# Altium project Source_Selector_V3.PrjPcb
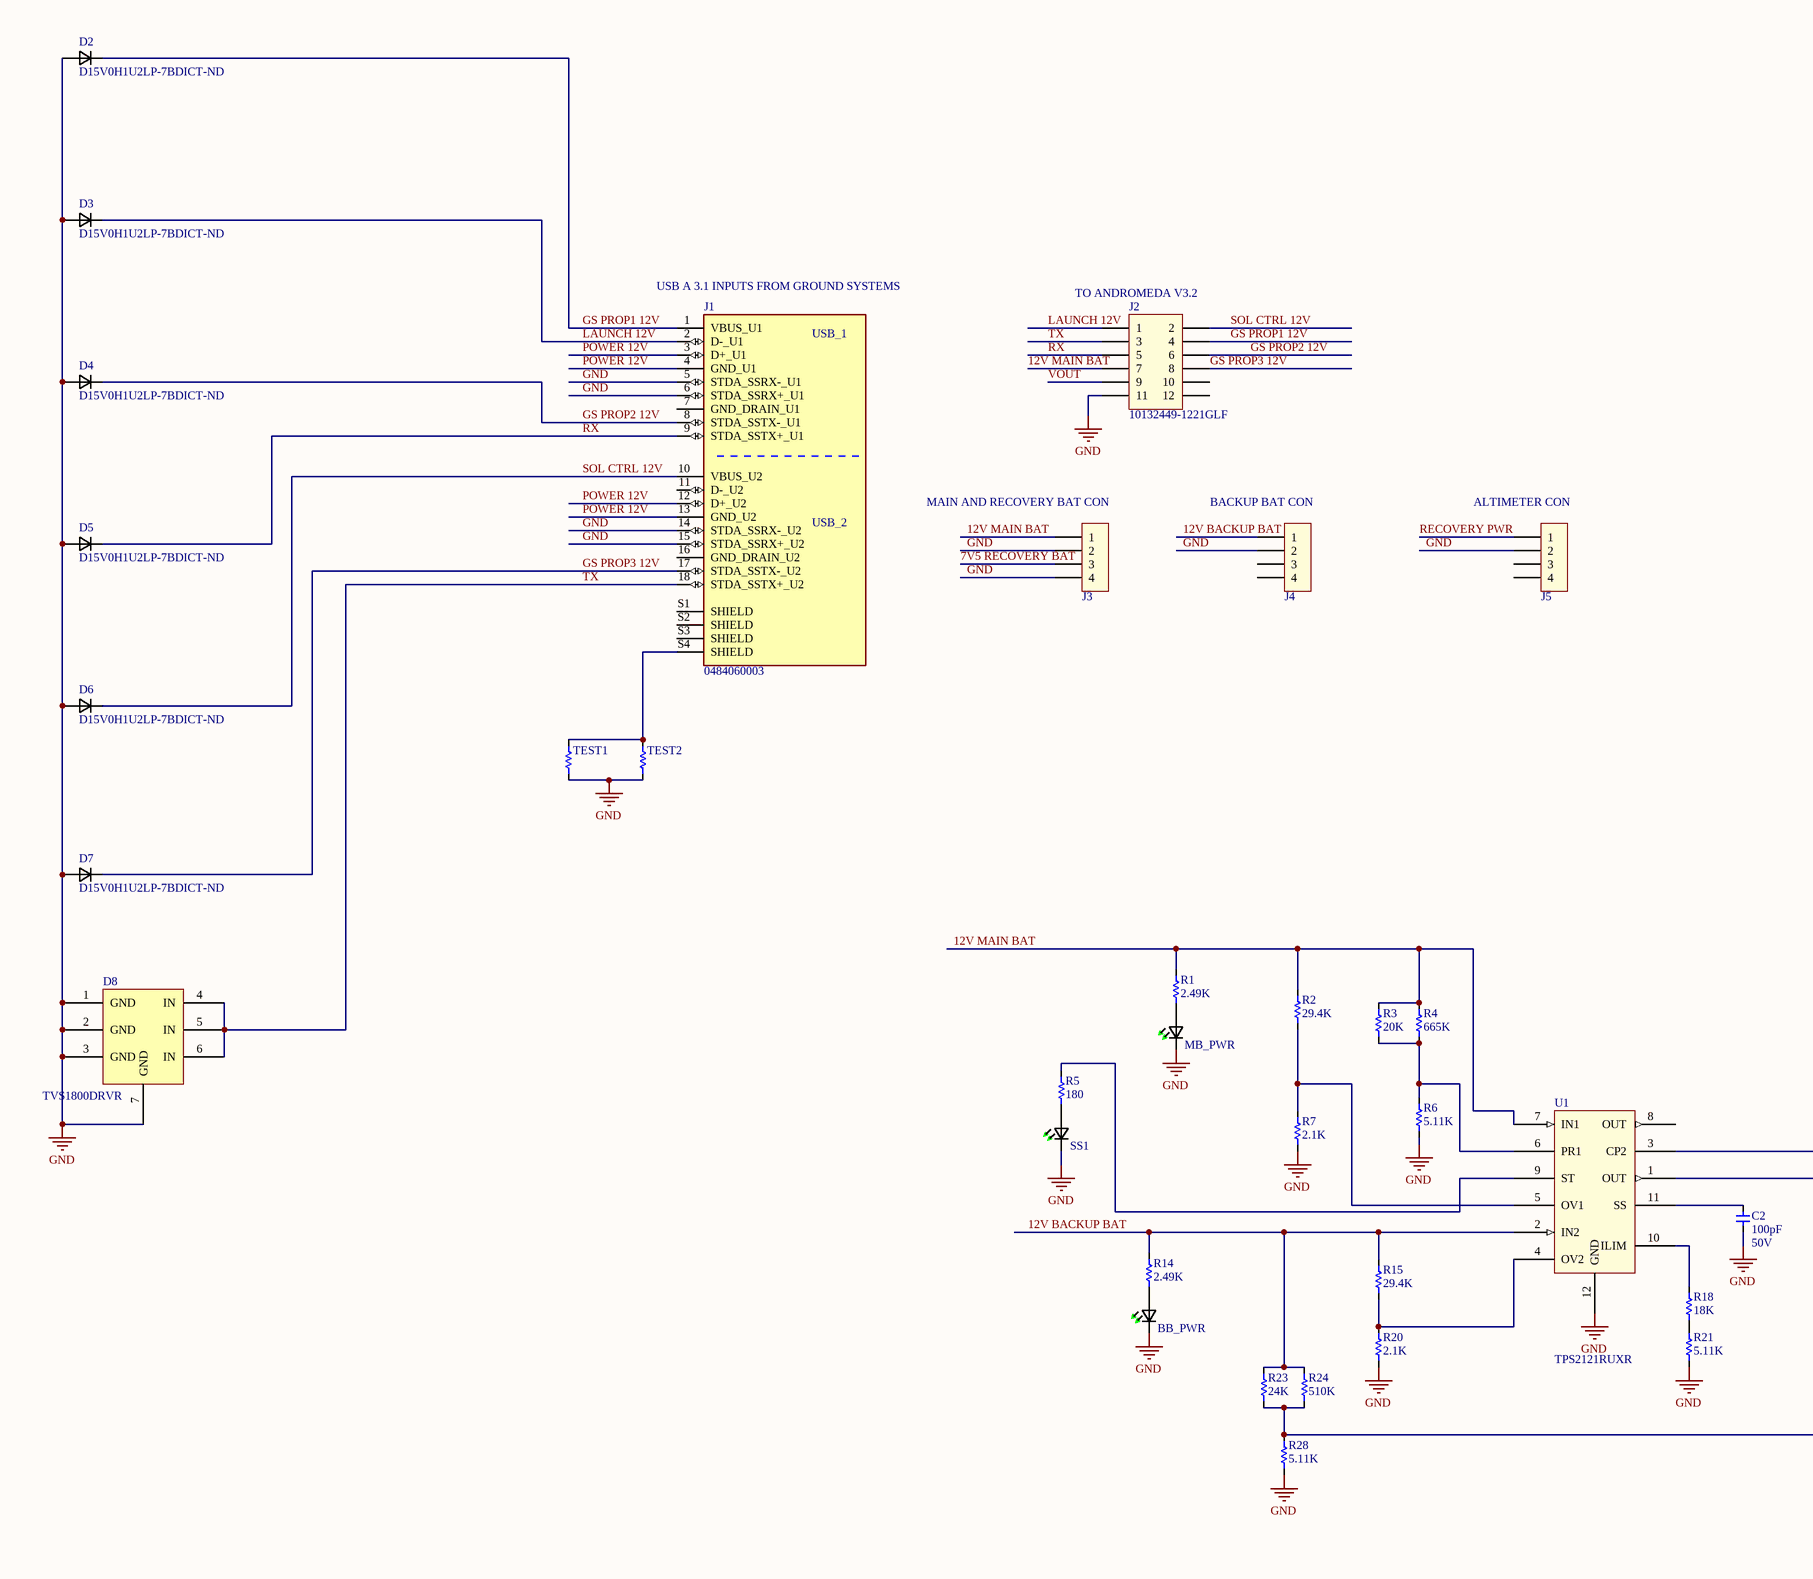
[diagram p0: Source_Selector_V3.SchDoc, left]
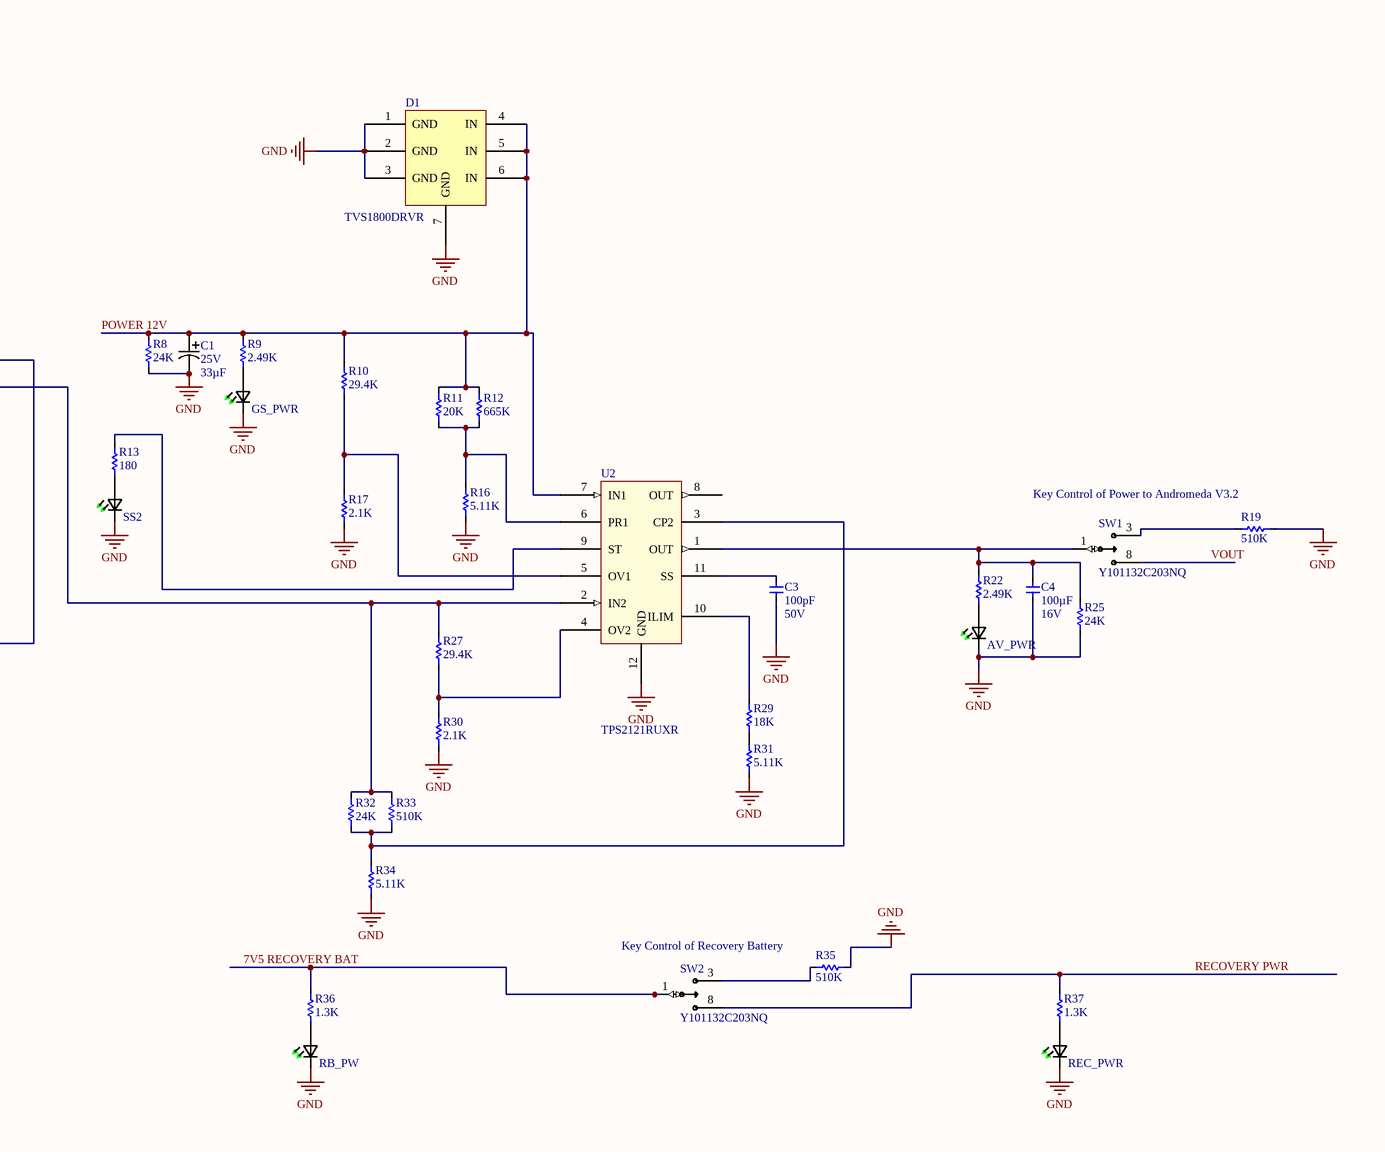
[diagram p1: Source_Selector_V3.SchDoc, right]
1 sheet, 67 parts. Net scope: global (net labels, ports and power ports of the same name join across sheets).
Board file: Source_Selector_V3.PcbDoc

## Sheet Source_Selector_V3.SchDoc
size A1

### Parts
AV_PWR  LTST-C191KGKT  [LTST-C191KGKT]  (value not drawn)
BB_PWR  LTST-C191KGKT  [LTST-C191KGKT]  (value not drawn)
C1  Voltage: 25V  Capacitance: 33µF  [PCAP_6.3x3-ELECT_NCA-M]  (hidden comment: UZG1E330MCL1GB)
C2  Capacitance: 100pF  Voltage - Rated: 50V  [0603[1608]]  (hidden comment: 04025A101JAT2A)
C3  Capacitance: 100pF  Voltage - Rated: 50V  [0603[1608]]  (hidden comment: 04025A101JAT2A)
C4  Capacitance: 100µF  Voltage - Rated: 16V  [CAPC3225X280N]  (hidden comment: EMK325ABJ107MM-P)
D1  TVS1800DRVR  [TVS1800DRVR]
D2  Supplier Part Number 1: D15V0H1U2LP-7BDICT-ND  [04025A101JAT2A]  (hidden comment: D15V0H1U2LP-7B)
D3  Supplier Part Number 1: D15V0H1U2LP-7BDICT-ND  [04025A101JAT2A]  (hidden comment: D15V0H1U2LP-7B)
D4  Supplier Part Number 1: D15V0H1U2LP-7BDICT-ND  [04025A101JAT2A]  (hidden comment: D15V0H1U2LP-7B)
D5  Supplier Part Number 1: D15V0H1U2LP-7BDICT-ND  [04025A101JAT2A]  (hidden comment: D15V0H1U2LP-7B)
D6  Supplier Part Number 1: D15V0H1U2LP-7BDICT-ND  [04025A101JAT2A]  (hidden comment: D15V0H1U2LP-7B)
D7  Supplier Part Number 1: D15V0H1U2LP-7BDICT-ND  [04025A101JAT2A]  (hidden comment: D15V0H1U2LP-7B)
D8  TVS1800DRVR  [TVS1800DRVR]
GS_PWR  LTST-C191KGKT  [LTST-C191KGKT]  (value not drawn)
J1  0484060003  [MOLEX_0484060003]
J2  10132449-1221GLF  [10132449-1221GLF]
J3  0430450400  [0430450400]  (value not drawn)
J4  0430450400  [0430450400]  (value not drawn)
J5  0430450400  [0430450400]  (value not drawn)
MB_PWR  LTST-C191KGKT  [LTST-C191KGKT]  (value not drawn)
R1  Resistance: 2.49K  [0603[1608]]  (hidden comment: ERA-3AEB2491V)
R2  Resistance: 29.4K  [0603[1608]]  (hidden comment: RMCF0603FT29K4)
R3  Resistance: 20K  [0603[1608]]  (hidden comment: RNCF0603BTC20K0)
R4  Resistance: 665K  [0603[1608]]  (hidden comment: RMCF0603FT665K)
R5  Resistance: 180  [0603[1608]]  (hidden comment: CRGCQ0603F180R)
R6  Resistance: 5.11K  [0603[1608]]  (hidden comment: RT0603BRD075K11L)
R7  Resistance: 2.1K  [0603[1608]]  (hidden comment: RQ73C1J2K1BTD)
R8  Resistance: 24K  [0603[1608]]  (hidden comment: RT0603BRD0724KL)
R9  Resistance: 2.49K  [0603[1608]]  (hidden comment: ERA-3AEB2491V)
R10  Resistance: 29.4K  [0603[1608]]  (hidden comment: RMCF0603FT29K4)
R11  Resistance: 20K  [0603[1608]]  (hidden comment: RNCF0603BTC20K0)
R12  Resistance: 665K  [0603[1608]]  (hidden comment: RMCF0603FT665K)
R13  Resistance: 180  [0603[1608]]  (hidden comment: CRGCQ0603F180R)
R14  Resistance: 2.49K  [0603[1608]]  (hidden comment: ERA-3AEB2491V)
R15  Resistance: 29.4K  [0603[1608]]  (hidden comment: RMCF0603FT29K4)
R16  Resistance: 5.11K  [0603[1608]]  (hidden comment: RT0603BRD075K11L)
R17  Resistance: 2.1K  [0603[1608]]  (hidden comment: RQ73C1J2K1BTD)
R18  Resistance: 18K  [0603[1608]]  (hidden comment: RT0603BRE0718KL)
R19  Resistance: 510K  [0603[1608]]  (hidden comment: CPF0603B510KE1)
R20  Resistance: 2.1K  [0603[1608]]  (hidden comment: RQ73C1J2K1BTD)
R21  Resistance: 5.11K  [0603[1608]]  (hidden comment: RT0603BRD075K11L)
R22  Resistance: 2.49K  [0603[1608]]  (hidden comment: ERA-3AEB2491V)
R23  Resistance: 24K  [0603[1608]]  (hidden comment: RT0603BRD0724KL)
R24  Resistance: 510K  [0603[1608]]  (hidden comment: CPF0603B510KE1)
R25  Resistance: 24K  [0603[1608]]  (hidden comment: RT0603BRD0724KL)
R27  Resistance: 29.4K  [0603[1608]]  (hidden comment: RMCF0603FT29K4)
R28  Resistance: 5.11K  [0603[1608]]  (hidden comment: RT0603BRD075K11L)
R29  Resistance: 18K  [0603[1608]]  (hidden comment: RT0603BRE0718KL)
R30  Resistance: 2.1K  [0603[1608]]  (hidden comment: RQ73C1J2K1BTD)
R31  Resistance: 5.11K  [0603[1608]]  (hidden comment: RT0603BRD075K11L)
R32  Resistance: 24K  [0603[1608]]  (hidden comment: RT0603BRD0724KL)
R33  Resistance: 510K  [0603[1608]]  (hidden comment: CPF0603B510KE1)
R34  Resistance: 5.11K  [0603[1608]]  (hidden comment: RT0603BRD075K11L)
R35  Resistance: 510K  [0603[1608]]  (hidden comment: CPF0603B510KE1)
R36  Resistance: 1.3K  [0603[1608]]  (hidden comment: MCT06030C1301FP500)
R37  Resistance: 1.3K  [0603[1608]]  (hidden comment: MCT06030C1301FP500)
RB_PW  LTST-C191KGKT  [LTST-C191KGKT]  (value not drawn)
REC_PWR  LTST-C191KGKT  [LTST-C191KGKT]  (value not drawn)
SS1  LTST-C191KGKT  [LTST-C191KGKT]  (value not drawn)
SS2  LTST-C191KGKT  [LTST-C191KGKT]  (value not drawn)
SW1  Y101132C203NQ  [Y101132C203NQ]
SW2  Y101132C203NQ  [Y101132C203NQ]
TEST1  RQ73C1J2K1BTD  [0603[1608]]  (value not drawn)
TEST2  RQ73C1J2K1BTD  [0603[1608]]  (value not drawn)
U1  TPS2121RUXR  [IC_TPS2121RUXR]
U2  TPS2121RUXR  [IC_TPS2121RUXR]

### Nets
GND: AV_PWR.1(K2) BB_PWR.1(K2) C1.2 C2.1 C3.1 C4.1 D1.1(GND) D1.2(GND) D1.3(GND) D1.7(GND) D2.2(A2) D3.2(A2) D4.2(A2) D5.2(A2) D6.2(A2) D7.2(A2) D8.1(GND) D8.2(GND) D8.3(GND) D8.7(GND) GS_PWR.1(K2) J1.5(STDA_SSRX-_U1) J1.6(STDA_SSRX+_U1) J1.14(STDA_SSRX-_U2) J1.15(STDA_SSRX+_U2) J2.11 J3.2 J3.4 J4.2 J5.2 MB_PWR.1(K2) R6.1 R7.1 R8.1 R16.1 R17.1 R19.1 R20.1 R21.1 R25.1 R28.1 R30.1 R31.1 R34.1 R35.1 RB_PW.1(K2) REC_PWR.1(K2) SS1.1(K2) SS2.1(K2) TEST1.1 TEST2.1 U1.12(GND) U2.12(GND)
7V5 RECOVERY BAT: J3.3 R36.2 SW2.1
12V BACKUP BAT: J4.1 R14.2 R15.2 R23.2 R24.2 U1.2(IN2)
12V MAIN BAT: J2.7 J3.1 R1.2 R2.2 R3.2 R4.2 U1.7(IN1)
GS PROP1 12V: D2.1(K2) J1.1(VBUS_U1) J2.4
GS PROP2 12V: D4.1(K2) J1.8(STDA_SSTX-_U1) J2.6
GS PROP3 12V: D7.1(K2) J1.17(STDA_SSTX-_U2) J2.8
LAUNCH 12V: D3.1(K2) J1.2(D-_U1) J2.1
POWER 12V: C1.1 D1.4(IN) D1.5(IN) D1.6(IN) J1.3(D+_U1) J1.4(GND_U1) J1.12(D+_U2) J1.13(GND_U2) R8.2 R9.2 R10.2 R11.2 R12.2 U2.7(IN1)
RECOVERY PWR: J5.1 R37.2 SW2.8
RX: D5.1(K2) J1.9(STDA_SSTX+_U1) J2.5
SOL CTRL 12V: D6.1(K2) J1.10(VBUS_U2) J2.2
TX: D8.4(IN) D8.5(IN) D8.6(IN) J1.18(STDA_SSTX+_U2) J2.3
VOUT: J2.9 SW1.8
NetAV_PWR_2: AV_PWR.2(A2) R22.1
NetBB_PWR_2: BB_PWR.2(A2) R14.1
NetC2_2: C2.2 U1.11(SS)
NetC3_2: C3.2 U2.11(SS)
NetC4_2: C4.2 R22.2 R25.2 SW1.1 U2.1(OUT)
NetGS_PWR_2: GS_PWR.2(A2) R9.1
NetJ1_S4: J1.S4(SHIELD) TEST1.2 TEST2.2
NetMB_PWR_2: MB_PWR.2(A2) R1.1
NetR2_1: R2.1 R7.2 U1.5(OV1)
NetR3_1: R3.1 R4.1 R6.2 U1.6(PR1)
NetR5_1: R5.1 SS1.2(A2)
NetR5_2: R5.2 U1.9(ST)
NetR10_1: R10.1 R17.2 U2.5(OV1)
NetR11_1: R11.1 R12.1 R16.2 U2.6(PR1)
NetR13_1: R13.1 SS2.2(A2)
NetR13_2: R13.2 U2.9(ST)
NetR15_1: R15.1 R20.2 U1.4(OV2)
NetR18_1: R18.1 R21.2
NetR18_2: R18.2 U1.10(ILIM)
NetR19_2: R19.2 SW1.3
NetR23_1: R23.1 R24.1 R28.2 U1.3(CP2)
NetR27_1: R27.1 R30.2 U2.4(OV2)
NetR27_2: R27.2 R32.2 R33.2 U1.1(OUT) U2.2(IN2)
NetR29_1: R29.1 R31.2
NetR29_2: R29.2 U2.10(ILIM)
NetR32_1: R32.1 R33.1 R34.2 U2.3(CP2)
NetR35_2: R35.2 SW2.3
NetR36_1: R36.1 RB_PW.2(A2)
NetR37_1: R37.1 REC_PWR.2(A2)

Not connected (* = marked no-connect by the designer): J1 7(GND_DRAIN_U1) 11(D-_U2) 16(GND_DRAIN_U2) S1(SHIELD) S2(SHIELD) S3(SHIELD); J2 10 12; J4 3 4; J5 3 4; U1 8(OUT); U2 8(OUT)

### Notes on the sheet
- (near J1) USB A 3.1 INPUTS FROM GROUND SYSTEMS
- (near J2) TO ANDROMEDA V3.2
- (near J3) MAIN AND RECOVERY BAT CON
- (near J4) BACKUP BAT CON
- (near J5) ALTIMETER CON
- Key Control of Power to Andromeda V3.2
- Key Control of Recovery Battery
- (in symbol 0484060003) USB_1; USB_2

### Library data of the parts
AV_PWR BB_PWR GS_PWR MB_PWR RB_PW REC_PWR SS1 SS2 = LTST-C191KGKT: LED GREEN CLEAR SMD 0603; Manufacturer: Lite-On Inc.; Lens Color: Colourless; Millicandela Rating: 35mcd; Lens Style: Rectangle with Flat Top; Lens Size: 1.10mm x 0.80mm; Voltage - Forward (Vf) (Typ): 2V; Current - Test: 20mA; Viewing Angle: 130°; Wavelength - Dominant: 571nm; Wavelength - Peak: 574nm; ComponentLink1Description: Datasheet; ComponentLink1URL: http://optoelectronics.liteon.com/upload/download/DS22-2000-228/LTST-C191KGKT.PDF; Manufacturer Part Number: LTST-C191KGKT; Colour: Green; Lens Transparency: Clear; Mounting Type: Surface Mount; Package / Case: 0603 (1608 Metric); Size / Dimension: 1.60mm L x 0.80mm W; Height (Max): 0.65mm; Supplier 1: Digi-Key; Supplier Part Number 1: 160-1446-1-ND
C1 = UZG1E330MCL1GB: CAP ALUM 33UF 20% 25V SMD; Manufacturer: Nichicon; Lifetime @ Temp.: 1000 Hrs @ 105°C; Ripple Current @ Low Frequency: 42mA @ 120Hz; Ripple Current @ High Frequency: 63mA @ 10kHz; Manufacturer_Part_Number: UZG1E330MCL1GB; Tolernace: ±20%; Operating Temp.: -40°C ~ 105°C
C2 C3 = 04025A101JAT2A: CAP CER 100PF 50V C0G/NP0 0402; Manufacturer: AVX Corporation; Tolerance: ±5%; Temperature Coefficient: C0G, NP0; Operating Temperature: -55°C ~ 125°C; Mounting Type: Surface Mount, MLCC; Package / Case: 0402 (1005 Metric); Size / Dimension: 0.039" L x 0.020" W (1.00mm x 0.50mm); Manufacturer Part Number: 04025A101JAT2A; Thickness (Max): 0.022" (0.56mm); ComponentLink1Description: Datasheet; ComponentLink1URL: http://datasheets.avx.com/C0GNP0-Dielectric.pdf; Supplier 1: Digi-Key; Supplier Part Number 1: 478-1082-1-ND
C4 = EMK325ABJ107MM-P: CAP CER 100UF 16V X5R 1210; Manufacturer: Taiyo Yuden; Tolerance: ±20%; Temperature Coefficient: X5R; Operating Temperature: -55°C ~ 85°C; Mounting Type: Surface Mount, MLCC; Package / Case: 1210 (3225 Metric); Size / Dimension: 0.126"" L x 0.098"" W (3.20mm x 2.50mm); Manufacturer Part Number: EMK325ABJ107MM-P; Thickness (Max): 0.110"" (2.80mm); ComponentLink1Description: Datasheet; ComponentLink1URL: https://ds.yuden.co.jp/TYCOMPAS/ut/detail?pn=EMK325ABJ107MM-P%20&u=M; Supplier 1: Digi-Key; Supplier Part Number 1: 587-5426-1-ND
D1 D8 = TVS1800DRVR: UNIDIR PRECISION SURGE DIODE; Voltage - Clamping: 24.7V; Mounting Type: Surface Mount; Manufacturer ID: TVS1800DRVR
D2-D7 = D15V0H1U2LP-7B: TVS DIODE 15VWM 27VC DFN1006-2; Manufacturer: Diodes Incorporated; ComponentLink1Description: Datasheet; ComponentLink1URL: http://optoelectronics.liteon.com/upload/download/DS22-2000-228/LTST-C191KGKT.PDF; Manufacturer Part Number: D15V0H1U2LP-7B; Supplier 1: Digi-Key
J1 = 0484060003: USB-A _USB TYPE-A_, Stacked USB 3.0 _USB 3.1 Gen 1, Superspeed_ Receptacle Connector 18 Position Through Hole, Right Angle; MF: Molex; Package: None; MP: 0484060003; Price: None; Availability: Unavailable; Value: *; SnapEDA_Link: https://www.snapeda.com/parts/0484060003/Molex/view-part/424547/?ref=snap
J2 = 10132449-1221GLF: CONN HEADER R/A 12POS 3MM; Manufacturer: Amphenol ICC (FCI); Pitch - Mating: 0.118" (3.00mm); Number of Positions: 12; Number of Positions Loaded: All; Style: Board to Cable/Wire; Shrouding: Shrouded - 4 Wall; Contact Length - Post: 0.126" (3.20mm); Material Flammability Rating: UL94 V-0; Voltage Rating: 250V; ComponentLink1Description: Datasheet; ComponentLink1URL: https://cdn.amphenol-icc.com/media/wysiwyg/files/documentation/datasheet/boardwiretoboard/bwb_minitekpwr3.0_hcc.pdf?__cf_chl_jschl_tk__=5b50c337d7977d3136f5a7e9c1a5138446a86722-1578191481-0-AdRe7fXYrldvOZ_oqyXIDS1Fw-yIkYCF-QCdaR8gv5bvudzwMePuF1OnY_qX9R1SRbUtnU8KyfMeQWvo-tgbYDs0UY0fEf2VYly7RnE44wN6RCRwe79pwwTkwB-vrp_E3FFt_m8Gv1l0VQgfDvqJJh9NWsFdXN6uiHYgEWJHQlxni9pgO_Rgu9b74Q_adNTuUPkDts4F_sjwuXFS2gwZ4qhDRVIbOsJk9z2IFwtIQbJe2Vjr12REDPUJnSIFI5L_m3PVR56FMV99EE0fexLx9E4Xzm8z4yXY4QuL_nxicuZLnFM8rKw84cv6VQDtrcv1h8b5URSWpnxkbKmN-6xqBT_N2gwuiomQytubllip4AB4QtXNO4uZy8p0Kaq8ZXDsS9f0XOGpGrNCvURFRCr5YrB2nakG2mZwStZMD_Rr-W-x1kEQ5VT0_Uar3vHfURsPPw; ComponentLink2Description: Drawing; ComponentLink2URL: https://cdn.amphenol-icc.com/media/wysiwyg/files/drawing/10132449.pdf?__cf_chl_jschl_tk__=3fb7538f61705fd3db72d6547b71e22025aaeae6-1578191484-0-ARZmBU2d2iTfwOyvkDW6juGvz8Wa7jPk-lPTAGC3bi6AwA2PAOw_83XbqimUoaj63c73oghkBl5EBlxfVnJt5FnKIy9_Ampqry6wpxN3P9yFfGzzu2bzrkjXc8H98cNGfE4yNZOx4lVYAc0DYF8iUgUBt3ot3PAqRWTuL_OE0dIKXvMd7u_4fU7igR1oB3QBFAu564mexcV1Dg4phJ9BA4kHFs6CIC10MmA2ZlPsaDWmfr6ivcYRarJOnVBN46Piz5s9Rafd2OkXuSIM4yJjlli4dKOItRDrJD3hRC0iA9RVgXipc9Ibd3Qny2RaW6xQiV-dovtBkpyFUGJQUyK5Difre6fQiv59Vrr2PfvD74WBgrERIBaIQ4JCRXFCC0XHSA; Supplier 1: Digi-Key; Supplier Part Number 1: 609-5289-ND; Contact Type: Male Pin; Number of Rows: 2; Row Spacing - Mating: 0.118" (3.00mm); Mounting Type: Through Hole, Right Angle; Termination: Solder; Fastening Type: Locking Ramp; Insulation Height: 0.343" (8.71mm); Contact Shape: Square; Contact Finish - Mating: Tin; Contact Finish - Post: Tin; Contact Material: Copper Alloy; Insulation Material: Polyamide (PA9T), Nylon 9T; Features: Board Lock, Glow Wire Compliant; Operating Temperature: -40°C ~ 105°C; Insulation Color: Black; Manufacturer Part Number: 10132449-1221GLF
J3-J5 = 0430450400: CONN HEADER R/A 4POS 3MM; Manufacturer: Molex; Number of Positions: 4; Row Spacing - Mating: 0.118" (3.00mm); Shrouding: Shrouded - 4 Wall; Contact Length - Post: 0.125" (3.18mm); Material Flammability Rating: UL94 V-0; Current Rating (Amps): 8A; Voltage Rating: 600V; ComponentLink1Description: Datasheet; ComponentLink1URL: https://www.molex.com/pdm_docs/sd/430450400_sd.pdf; ComponentLink2Description: Product Specification; ComponentLink2URL: https://www.molex.com/pdm_docs/ps/PS-43045.pdf; Manufacturer Part Number: 0430450400; Contact Type: 0.118" (3.00mm); Number of Rows: 2; Mounting Type: Through Hole, Right Angle; Termination: Solder; Fastening Type: Locking Ramp; Insulation Height: 0.290" (7.37mm); Contact Shape: Square; Contact Finish - Mating: Tin; Contact Finish Thickness - Mating: 100.0µin (2.54µm); Contact Finish - Post: Tin; Contact Material: Brass; Insulation Material: Liquid Crystal Polymer (LCP), Glass Filled; Features: Board Lock; Insulation Color: Black; Supplier 1: Digi-Key; Supplier Part Number 1: WM1814-ND
R1 R9 R14 R22 = ERA-3AEB2491V: RES SMD 2.49KOHM 0.1% 1/10W 0603; Manufacturer: Panasonic Electronic Components; Power  (W): 0.1W; Temperature Coefficient: ±25ppm/°C; Package: 0603 (1608 Metric); Tolerance: ±0.1%; Operating Temperature: -55°C ~ 155°C; Composition: Thin Film; Manufacturer Part Number: ERA-3AEB2491V; ComponentLink1Description: Datasheet; ComponentLink1URL: https://industrial.panasonic.com/cdbs/www-data/pdf/RDM0000/AOA0000C307.pdf; Supplier 1: Digi-Key; Supplier Part Number 1: P2.49KDBCT-ND
R2 R10 R15 R27 = RMCF0603FT29K4: RES 29.4K OHM 1% 1/10W 0603; Manufacturer: Stackpole Electronics Inc; Power  (W): 0.1W; Temperature Coefficient: ±100ppm/°C; Package: 0603 (1608 Metric); Tolerance: ±1%; Operating Temperature: -55°C ~ 155°C; Composition: Thick Film; Manufacturer Part Number: RMCF0603FT29K4; Supplier 1: Digi-Key; Supplier Part Number 1: 738-RMCF0603FT29K4CT-ND
R3 R11 = RNCF0603BTC20K0: RES 20K OHM 0.1% 1/10W 0603; Manufacturer: Stackpole Electronics Inc; Power  (W): 0.1W; Temperature Coefficient: ±50ppm/°C; Package: 0603 (1608 Metric); Tolerance: ±0.1%; Operating Temperature: -55°C ~ 155°C; Composition: Thin Film; Manufacturer Part Number: RNCF0603BTC20K0; ComponentLink1Description: Datasheet; ComponentLink1URL: https://www.seielect.com/catalog/sei-rncf.pdf; Supplier 1: Digi-Key; Supplier Part Number 1: RNCF0603BTC20K0CT-ND
R4 R12 = RMCF0603FT665K: RES 665K OHM 1% 1/10W 0603; Manufacturer: Stackpole Electronics Inc; Power  (W): 0.1W; Temperature Coefficient: ±100ppm/°C; Package: 0603 (1608 Metric); Tolerance: ±1%; Operating Temperature: -55°C ~ 155°C; Composition: Thick Film; Manufacturer Part Number: RMCF0603FT665K; ComponentLink1Description: Datasheet; ComponentLink1URL: https://www.seielect.com/catalog/sei-rmcf_rmcp.pdf; Supplier 1: Digi-Key; Supplier Part Number 1: RMCF0603FT665KCT-ND
R5 R13 = CRGCQ0603F180R: RES 180 OHM 1% 1/10W 0603; Manufacturer: TE Connectivity Passive Product; Power  (W): 0.1W; Tolerance: ±0.1%; Temperature Coefficient: ±50ppm/°C; Package: 0603 (1608 Metric); Operating Temperature: -55°C ~ 155°C; Composition: Thin Film; Manufacturer Part Number: CRGCQ0603F180R; ComponentLink1Description: Datasheet; ComponentLink1URL: https://www.yageo.com/upload/media/product/productsearch/datasheet/rchip/PYu-RT_1-to-0.01_RoHS_L_12.pdf; Supplier 1: Digi-Key; Supplier Part Number 1: A129679CT-ND
R6 R16 R21 R28 R31 R34 = RT0603BRD075K11L: RES SMD 5.11KOHM 0.1% 1/10W 0603; Manufacturer: Yageo; Power  (W): 0.1W; Temperature Coefficient: ±25ppm/°C; Package: 0603 (1608 Metric); Tolerance: ±0.1%; Operating Temperature: -55°C ~ 155°C; Composition: Thin Film; Manufacturer Part Number: RT0603BRD075K11L; ComponentLink1Description: Datasheet; ComponentLink1URL: https://www.yageo.com/upload/media/product/productsearch/datasheet/rchip/PYu-RT_1-to-0.01_RoHS_L_12.pdf; Supplier 1: Digi-Key; Supplier Part Number 1: YAG1695CT-ND
R7 R17 R20 R30 TEST1 TEST2 = RQ73C1J2K1BTD: RES 2.1 KOHMS 0.1% 0.15W 0603; Manufacturer: TE Connectivity Passive Product; Power  (W): 0.1W; Temperature Coefficient: ±10ppm/°C; Package: 0603 (1608 Metric); Tolerance: ±0.1%; Operating Temperature: -55°C ~ 155°C; Composition: Thin Film; Manufacturer Part Number: RQ73C1J2K1BTD; ComponentLink1Description: Datasheet; ComponentLink1URL: https://media.digikey.com/pdf/Data%20Sheets/Tyco%20Electronics%20P%20B%20PDFs/RQ73-0618%20v2.pdf; Supplier 1: Digi-Key
  R7 R17 R20 R30: Supplier Part Number 1: A140446TR-ND
R8 R23 R25 R32 = RT0603BRD0724KL: RES SMD 24K OHM 0.1% 1/10W 0603; Manufacturer: Yageo; Power  (W): 0.1W; Temperature Coefficient: ±25ppm/°C; Package: 0603 (1608 Metric); Tolerance: ±0.1%; Operating Temperature: -55°C ~ 155°C; Composition: Thin Film; Manufacturer Part Number: RT0603BRD0724KL; ComponentLink1Description: Datasheet; ComponentLink1URL: https://www.yageo.com/upload/media/product/productsearch/datasheet/rchip/PYu-RT_1-to-0.01_RoHS_L_12.pdf; Supplier 1: Digi-Key; Supplier Part Number 1: YAG1600CT-ND
R18 R29 = RT0603BRE0718KL: RES SMD 18K OHM 0.1% 1/10W 0603; Manufacturer: Yageo; Power  (W): 0.1W; Temperature Coefficient: ±50ppm/°C; Package: 0603 (1608 Metric); Tolerance: ±0.1%; Operating Temperature: -55°C ~ 155°C; Composition: Thin Film; Manufacturer Part Number: RT0603BRE0718KL; ComponentLink1Description: Datasheet; ComponentLink1URL: https://www.yageo.com/upload/media/product/productsearch/datasheet/rchip/PYu-RT_1-to-0.01_RoHS_L_12.pdf; Supplier 1: Digi-Key; Supplier Part Number 1: YAG4641CT-ND
R19 R24 R33 R35 = CPF0603B510KE1: RES SMD 510K OHM 0.1% 1/16W 0603; Manufacturer: TE Connectivity Passive Product; Temperature Coefficient: ±25ppm/°C; Power  (W): 1/16W; Package: 0603 (1608 Metric); Tolerance: ±0.1%; Operating Temperature: -55°C ~ 155°C; Composition: Thin Film; Manufacturer Part Number: CPF0603B510KE1; ComponentLink1Description: Datasheet; ComponentLink1URL: https://www.te.com/commerce/DocumentDelivery/DDEController?Action=srchrtrv&DocNm=1773200&DocType=DS&DocLang=English; Supplier 1: Digi-Key; Supplier Part Number 1: A102291CT-ND
R36 R37 = MCT06030C1301FP500: RES SMD 1.3K OHM 1% 1/8W 0603; Manufacturer: Vishay Beyschlag; Temperature Coefficient: ±50ppm/°C; Power  (W): 1/8W; Package: 0603 (1608 Metric); Tolerance: ±1%; Operating Temperature: -55°C ~ 155°C; Composition: Thin Film; Manufacturer Part Number: MCT06030C1301FP500; ComponentLink1Description: Datasheet; ComponentLink1URL: http://www.vishay.com/docs/28705/mcx0x0xpro.pdf; Supplier 1: Digi-Key; Supplier Part Number 1: 749-1605-1-ND
SW1 SW2 = Y101132C203NQ: SWITCH KEYLOCK 2POS SPDT 4A 125V; Manufacturer: C&K; Number of Positions: 2; Switch Function: On-On; Contact Timing: Not Specified; Current Rating (Amps): 4A (AC/DC); Angle of Throw: 90°; Key Removable Positions: 1 only; Actuator Type: Flat Key; Voltage Rating - DC: 28V; Electrical Life: 10,000 Cycles; ComponentLink1Description: Datasheet; ComponentLink1URL: https://dznh3ojzb2azq.cloudfront.net/products/Switchlock/Y/documents/datasheet.pdf; Supplier 1: Digi-Key; Supplier Part Number 1: CKN11517-ND; Manufacturer Part Number: Y101132C203NQ; Circuit: SPDT; Voltage Rating - AC: 125V; Contact Material: Copper; Contact Finish: Silver; Mounting Type: Panel Mount; Depth Behind Flange: 28.83mm; Panel Cutout Dimensions: Circular - 19.30mm Dia; Termination Style: Solder Lug
U1 U2 = TPS2121RUXR: PWR MGMT BATTERY MGMT; ComponentLink1Description: Datasheet; ComponentLink1URL: https://www.ti.com/general/docs/suppproductinfo.tsp?distId=10&gotoUrl=http%253A%252F%252Fwww.ti.com%252Flit%252Fgpn%252Ftps2120; Supplier 1: Arrow Electronics; Supplier Part Number 1: TPS2121RUXR